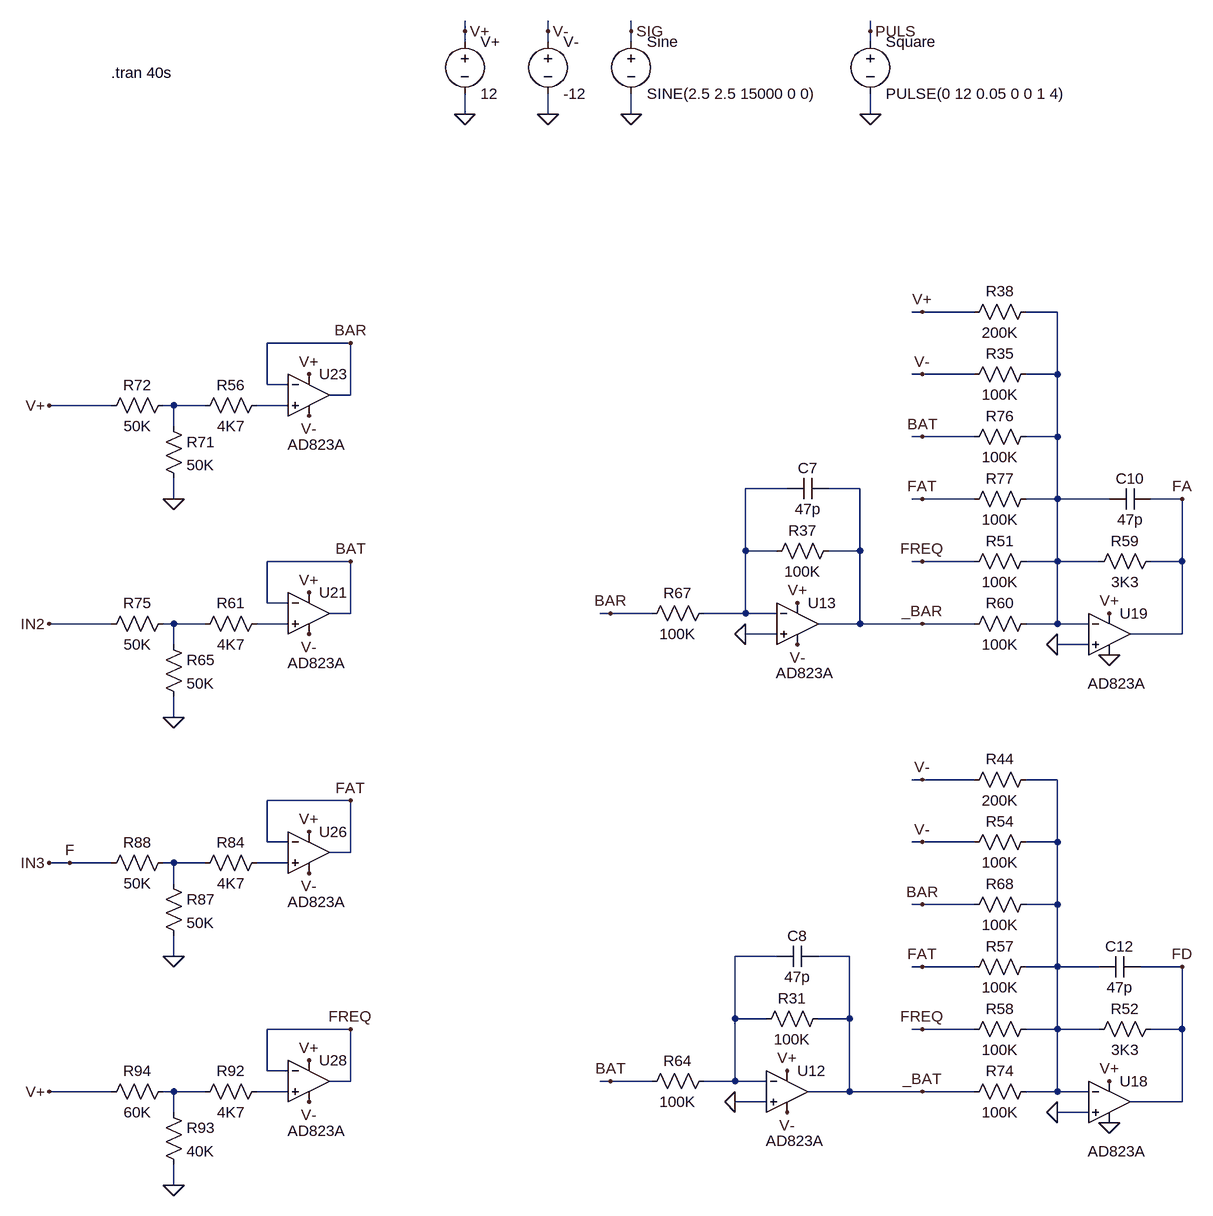
[diagram p0: schematic Function ctrl.asc]
Function ctrl.asc, the LTspice schematic file:
Version 4
SHEET 1 1408 3424
WIRE -912 -1408 -912 -1424
WIRE -784 -1408 -784 -1424
WIRE -656 -1408 -656 -1424
WIRE -288 -1408 -288 -1424
WIRE -912 -1392 -912 -1408
WIRE -784 -1392 -784 -1408
WIRE -656 -1392 -656 -1408
WIRE -288 -1392 -288 -1408
WIRE -912 -1280 -912 -1312
WIRE -784 -1280 -784 -1312
WIRE -656 -1280 -656 -1312
WIRE -288 -1280 -288 -1312
WIRE -208 -976 -224 -976
WIRE -128 -976 -208 -976
WIRE 0 -976 -48 -976
WIRE -1088 -928 -1216 -928
WIRE -208 -880 -224 -880
WIRE -128 -880 -208 -880
WIRE 0 -880 0 -976
WIRE 0 -880 -48 -880
WIRE -1216 -864 -1216 -928
WIRE -1184 -864 -1216 -864
WIRE -1088 -848 -1088 -928
WIRE -1088 -848 -1120 -848
WIRE -1456 -832 -1552 -832
WIRE -1360 -832 -1376 -832
WIRE -1312 -832 -1360 -832
WIRE -1184 -832 -1232 -832
WIRE -1360 -800 -1360 -832
WIRE -208 -784 -224 -784
WIRE -128 -784 -208 -784
WIRE 0 -784 0 -880
WIRE 0 -784 -48 -784
WIRE -416 -704 -480 -704
WIRE -304 -704 -352 -704
WIRE -1360 -688 -1360 -720
WIRE -208 -688 -224 -688
WIRE -128 -688 -208 -688
WIRE 0 -688 0 -784
WIRE 0 -688 -48 -688
WIRE 80 -688 0 -688
WIRE 192 -688 144 -688
WIRE -480 -608 -480 -704
WIRE -432 -608 -480 -608
WIRE -304 -608 -304 -704
WIRE -304 -608 -352 -608
WIRE -1088 -592 -1216 -592
WIRE -208 -592 -224 -592
WIRE -128 -592 -208 -592
WIRE 0 -592 0 -688
WIRE 0 -592 -48 -592
WIRE 64 -592 0 -592
WIRE 192 -592 192 -688
WIRE 192 -592 144 -592
WIRE -1216 -528 -1216 -592
WIRE -1184 -528 -1216 -528
WIRE -1088 -512 -1088 -592
WIRE -1088 -512 -1120 -512
WIRE -688 -512 -704 -512
WIRE -624 -512 -688 -512
WIRE -480 -512 -480 -608
WIRE -480 -512 -544 -512
WIRE -432 -512 -480 -512
WIRE -1456 -496 -1552 -496
WIRE -1360 -496 -1376 -496
WIRE -1312 -496 -1360 -496
WIRE -1184 -496 -1232 -496
WIRE -304 -496 -304 -608
WIRE -304 -496 -368 -496
WIRE -208 -496 -304 -496
WIRE -128 -496 -208 -496
WIRE 0 -496 0 -592
WIRE 0 -496 -48 -496
WIRE 48 -496 0 -496
WIRE -432 -480 -480 -480
WIRE 192 -480 192 -592
WIRE 192 -480 112 -480
WIRE -1360 -464 -1360 -496
WIRE 48 -464 0 -464
WIRE -1360 -352 -1360 -384
WIRE -208 -256 -224 -256
WIRE -128 -256 -208 -256
WIRE 0 -256 -48 -256
WIRE -1088 -224 -1216 -224
WIRE -1216 -160 -1216 -224
WIRE -1184 -160 -1216 -160
WIRE -208 -160 -224 -160
WIRE -128 -160 -208 -160
WIRE 0 -160 0 -256
WIRE 0 -160 -48 -160
WIRE -1088 -144 -1088 -224
WIRE -1088 -144 -1120 -144
WIRE -1520 -128 -1552 -128
WIRE -1456 -128 -1520 -128
WIRE -1360 -128 -1376 -128
WIRE -1312 -128 -1360 -128
WIRE -1184 -128 -1232 -128
WIRE -1360 -96 -1360 -128
WIRE -208 -64 -224 -64
WIRE -128 -64 -208 -64
WIRE 0 -64 0 -160
WIRE 0 -64 -48 -64
WIRE -1360 16 -1360 -16
WIRE -432 16 -496 16
WIRE -320 16 -368 16
WIRE -208 32 -224 32
WIRE -128 32 -208 32
WIRE 0 32 0 -64
WIRE 0 32 -48 32
WIRE 64 32 0 32
WIRE 192 32 128 32
WIRE -496 112 -496 16
WIRE -448 112 -496 112
WIRE -320 112 -320 16
WIRE -320 112 -368 112
WIRE -1088 128 -1216 128
WIRE -208 128 -224 128
WIRE -128 128 -208 128
WIRE 0 128 0 32
WIRE 0 128 -48 128
WIRE 64 128 0 128
WIRE 192 128 192 32
WIRE 192 128 144 128
WIRE -1216 192 -1216 128
WIRE -1184 192 -1216 192
WIRE -1088 208 -1088 128
WIRE -1088 208 -1120 208
WIRE -688 208 -704 208
WIRE -624 208 -688 208
WIRE -496 208 -496 112
WIRE -496 208 -544 208
WIRE -448 208 -496 208
WIRE -1456 224 -1552 224
WIRE -1360 224 -1376 224
WIRE -1312 224 -1360 224
WIRE -1184 224 -1232 224
WIRE -320 224 -320 112
WIRE -320 224 -384 224
WIRE -208 224 -320 224
WIRE -128 224 -208 224
WIRE 0 224 0 128
WIRE 0 224 -48 224
WIRE 48 224 0 224
WIRE -448 240 -496 240
WIRE 192 240 192 128
WIRE 192 240 112 240
WIRE -1360 256 -1360 224
WIRE 48 256 0 256
WIRE -1360 368 -1360 336
FLAG -912 -1280 0
FLAG -656 -1280 0
FLAG -784 -1280 0
FLAG -912 -1408 V+
FLAG -784 -1408 V-
FLAG -656 -1408 SIG
FLAG -400 -464 V-
FLAG -400 -528 V+
FLAG -288 -1280 0
FLAG -288 -1408 PULS
FLAG -1552 -496 IN2
FLAG -1152 -544 V+
FLAG -1152 -480 V-
FLAG -1360 -352 0
FLAG -1152 -880 V+
FLAG -1152 -816 V-
FLAG -1360 -688 0
FLAG -1552 -832 V+
FLAG -1552 -128 IN3
FLAG -1520 -128 F
FLAG -1152 -176 V+
FLAG -1152 -112 V-
FLAG -1360 16 0
FLAG -1152 176 V+
FLAG -1152 240 V-
FLAG -1360 368 0
FLAG -1552 224 V+
FLAG -1088 128 FREQ
FLAG -1088 -928 BAR
FLAG -1088 -224 FAT
FLAG -1088 -592 BAT
FLAG -208 -592 FREQ
FLAG -480 -480 0
FLAG -416 256 V-
FLAG -416 192 V+
FLAG 80 208 V+
FLAG 0 256 0
FLAG 192 32 FD
FLAG 80 272 0
FLAG -208 32 FAT
FLAG -208 128 FREQ
FLAG -496 240 0
FLAG -688 -512 BAR
FLAG -208 -64 BAR
FLAG 80 -512 V+
FLAG 0 -464 0
FLAG 192 -688 FA
FLAG 80 -448 0
FLAG -688 208 BAT
FLAG -208 -784 BAT
FLAG -208 -688 FAT
FLAG -208 -160 V-
FLAG -208 224 _BAT
FLAG -208 -496 _BAR
FLAG -208 -880 V-
FLAG -208 -976 V+
FLAG -208 -256 V-
SYMBOL voltage -912 -1408 R0
SYMATTR InstName V+
SYMATTR Value 12
SYMBOL voltage -656 -1408 R0
SYMATTR InstName Sine
SYMATTR Value SINE(2.5 2.5 15000 0 0)
SYMBOL voltage -784 -1408 R0
SYMATTR InstName V-
SYMATTR Value -12
SYMBOL Res -336 -624 R90
WINDOW 0 0 56 VBottom 2
WINDOW 3 32 56 VTop 2
SYMATTR InstName R37
SYMATTR Value 100K
SYMBOL OpAmps/AD823A -400 -560 R0
WINDOW 3 -33 140 Left 2
SYMATTR InstName U13
SYMBOL Cap -352 -720 R90
WINDOW 0 0 32 VBottom 2
WINDOW 3 32 32 VTop 2
SYMATTR InstName C7
SYMATTR Value 47p
SYMBOL voltage -288 -1408 R0
SYMATTR InstName Square
SYMATTR Value PULSE(0 12 0.05 0 0 1 4)
SYMBOL Res -32 -512 R90
WINDOW 0 0 56 VBottom 2
WINDOW 3 32 56 VTop 2
SYMATTR InstName R60
SYMATTR Value 100K
SYMBOL OpAmps/AD823A -1152 -576 R0
WINDOW 3 -33 140 Left 2
SYMATTR InstName U21
SYMBOL Res -1216 -512 R90
WINDOW 0 0 56 VBottom 2
WINDOW 3 32 56 VTop 2
SYMATTR InstName R61
SYMATTR Value 4K7
SYMBOL Res -1376 -480 R0
SYMATTR InstName R65
SYMATTR Value 50K
SYMBOL Res -1360 -512 R90
WINDOW 0 0 56 VBottom 2
WINDOW 3 32 56 VTop 2
SYMATTR InstName R75
SYMATTR Value 50K
SYMBOL OpAmps/AD823A -1152 -912 R0
WINDOW 3 -33 140 Left 2
SYMATTR InstName U23
SYMBOL Res -1216 -848 R90
WINDOW 0 0 56 VBottom 2
WINDOW 3 32 56 VTop 2
SYMATTR InstName R56
SYMATTR Value 4K7
SYMBOL Res -1376 -816 R0
SYMATTR InstName R71
SYMATTR Value 50K
SYMBOL Res -1360 -848 R90
WINDOW 0 0 56 VBottom 2
WINDOW 3 32 56 VTop 2
SYMATTR InstName R72
SYMATTR Value 50K
SYMBOL OpAmps/AD823A -1152 -208 R0
WINDOW 3 -33 140 Left 2
SYMATTR InstName U26
SYMBOL Res -1216 -144 R90
WINDOW 0 0 56 VBottom 2
WINDOW 3 32 56 VTop 2
SYMATTR InstName R84
SYMATTR Value 4K7
SYMBOL Res -1376 -112 R0
SYMATTR InstName R87
SYMATTR Value 50K
SYMBOL Res -1360 -144 R90
WINDOW 0 0 56 VBottom 2
WINDOW 3 32 56 VTop 2
SYMATTR InstName R88
SYMATTR Value 50K
SYMBOL OpAmps/AD823A -1152 144 R0
WINDOW 3 -33 140 Left 2
SYMATTR InstName U28
SYMBOL Res -1216 208 R90
WINDOW 0 0 56 VBottom 2
WINDOW 3 32 56 VTop 2
SYMATTR InstName R92
SYMATTR Value 4K7
SYMBOL Res -1376 240 R0
SYMATTR InstName R93
SYMATTR Value 40K
SYMBOL Res -1360 208 R90
WINDOW 0 0 56 VBottom 2
WINDOW 3 32 56 VTop 2
SYMATTR InstName R94
SYMATTR Value 60K
SYMBOL Res -144 -576 R270
WINDOW 0 32 56 VTop 2
WINDOW 3 0 56 VBottom 2
SYMATTR InstName R51
SYMATTR Value 100K
SYMBOL Res -352 96 R90
WINDOW 0 0 56 VBottom 2
WINDOW 3 32 56 VTop 2
SYMATTR InstName R31
SYMATTR Value 100K
SYMBOL OpAmps/AD823A -416 160 R0
WINDOW 3 -33 140 Left 2
SYMATTR InstName U12
SYMBOL Cap -368 0 R90
WINDOW 0 0 32 VBottom 2
WINDOW 3 32 32 VTop 2
SYMATTR InstName C8
SYMATTR Value 47p
SYMBOL Res 160 112 R90
WINDOW 0 0 56 VBottom 2
WINDOW 3 32 56 VTop 2
SYMATTR InstName R52
SYMATTR Value 3K3
SYMBOL OpAmps/AD823A 80 176 R0
WINDOW 3 -33 140 Left 2
SYMATTR InstName U18
SYMBOL Cap 128 16 R90
WINDOW 0 0 32 VBottom 2
WINDOW 3 32 32 VTop 2
SYMATTR InstName C12
SYMATTR Value 47p
SYMBOL Res -144 48 R270
WINDOW 0 32 56 VTop 2
WINDOW 3 0 56 VBottom 2
SYMATTR InstName R57
SYMATTR Value 100K
SYMBOL Res -144 144 R270
WINDOW 0 32 56 VTop 2
WINDOW 3 0 56 VBottom 2
SYMATTR InstName R58
SYMATTR Value 100K
SYMBOL Res -640 224 R270
WINDOW 0 32 56 VTop 2
WINDOW 3 0 56 VBottom 2
SYMATTR InstName R64
SYMATTR Value 100K
SYMBOL Res -640 -496 R270
WINDOW 0 32 56 VTop 2
WINDOW 3 0 56 VBottom 2
SYMATTR InstName R67
SYMATTR Value 100K
SYMBOL Res -144 -48 R270
WINDOW 0 32 56 VTop 2
WINDOW 3 0 56 VBottom 2
SYMATTR InstName R68
SYMATTR Value 100K
SYMBOL Res 160 -608 R90
WINDOW 0 0 56 VBottom 2
WINDOW 3 32 56 VTop 2
SYMATTR InstName R59
SYMATTR Value 3K3
SYMBOL OpAmps/AD823A 80 -544 R0
WINDOW 3 -33 140 Left 2
SYMATTR InstName U19
SYMBOL Cap 144 -704 R90
WINDOW 0 0 32 VBottom 2
WINDOW 3 32 32 VTop 2
SYMATTR InstName C10
SYMATTR Value 47p
SYMBOL Res -144 240 R270
WINDOW 0 32 56 VTop 2
WINDOW 3 0 56 VBottom 2
SYMATTR InstName R74
SYMATTR Value 100K
SYMBOL Res -144 -768 R270
WINDOW 0 32 56 VTop 2
WINDOW 3 0 56 VBottom 2
SYMATTR InstName R76
SYMATTR Value 100K
SYMBOL Res -144 -672 R270
WINDOW 0 32 56 VTop 2
WINDOW 3 0 56 VBottom 2
SYMATTR InstName R77
SYMATTR Value 100K
SYMBOL Res -144 -144 R270
WINDOW 0 32 56 VTop 2
WINDOW 3 0 56 VBottom 2
SYMATTR InstName R54
SYMATTR Value 100K
SYMBOL Res -144 -864 R270
WINDOW 0 32 56 VTop 2
WINDOW 3 0 56 VBottom 2
SYMATTR InstName R35
SYMATTR Value 100K
SYMBOL Res -144 -960 R270
WINDOW 0 32 56 VTop 2
WINDOW 3 0 56 VBottom 2
SYMATTR InstName R38
SYMATTR Value 200K
SYMBOL Res -144 -240 R270
WINDOW 0 32 56 VTop 2
WINDOW 3 0 56 VBottom 2
SYMATTR InstName R44
SYMATTR Value 200K
TEXT -1456 -1344 Left 2 !.tran 40s

The netlist it stands for:
* Function ctrl.asc
V+ V+ 0 12
V§Sine SIG 0 SINE(2.5 2.5 15000 0 0)
V- V- 0 -12
R37 _BAR N004 100K
XU13 0 N004 V+ V- _BAR AD823A  ; pins In+ In- V+ V- OUT
C7 _BAR N004 47p
V§Square PULS 0 PULSE(0 12 0.05 0 0 1 4)
R60 N001 _BAR 100K
XU21 N006 BAT V+ V- BAT AD823A  ; pins In+ In- V+ V- OUT
R61 N006 N005 4K7
R65 N005 0 50K
R75 N005 IN2 50K
XU23 N003 BAR V+ V- BAR AD823A  ; pins In+ In- V+ V- OUT
R56 N003 N002 4K7
R71 N002 0 50K
R72 N002 V+ 50K
XU26 N009 FAT V+ V- FAT AD823A  ; pins In+ In- V+ V- OUT
R84 N009 N008 4K7
R87 N008 0 50K
R88 N008 F 50K
XU28 N012 FREQ V+ V- FREQ AD823A  ; pins In+ In- V+ V- OUT
R92 N012 N011 4K7
R93 N011 0 40K
R94 N011 V+ 60K
R51 FREQ N001 100K
R31 _BAT N010 100K
XU12 0 N010 V+ V- _BAT AD823A  ; pins In+ In- V+ V- OUT
C8 _BAT N010 47p
R52 FD N007 3K3
XU18 0 N007 V+ 0 FD AD823A  ; pins In+ In- V+ V- OUT
C12 FD N007 47p
R57 FAT N007 100K
R58 FREQ N007 100K
R64 BAT N010 100K
R67 BAR N004 100K
R68 BAR N007 100K
R59 FA N001 3K3
XU19 0 N001 V+ 0 FA AD823A  ; pins In+ In- V+ V- OUT
C10 FA N001 47p
R74 _BAT N007 100K
R76 BAT N001 100K
R77 FAT N001 100K
R54 V- N007 100K
R35 V- N001 100K
R38 V+ N001 200K
R44 V- N007 200K
.tran 40s
.backanno
.end